# Altium schematic sheet TEST_PLATFORM.SchDoc
size A4
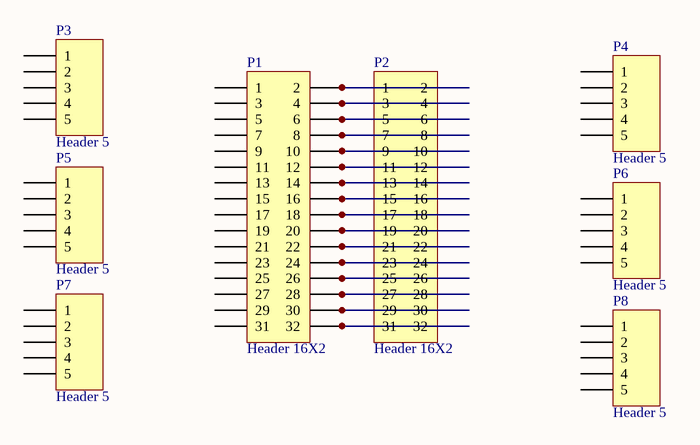
[diagram p0: TEST_PLATFORM.SchDoc]

## Parts
P1  Header 16X2  [HDR2X16]
P2  Header 16X2  [HDR2X16]
P3  Header 5  [HDR1X5]
P4  Header 5  [HDR1X5]
P5  Header 5  [HDR1X5]
P6  Header 5  [HDR1X5]
P7  Header 5  [HDR1X5]
P8  Header 5  [HDR1X5]

## Nets
NetP1_2: P1.2 P2.1 P2.2
NetP1_4: P1.4 P2.3 P2.4
NetP1_6: P1.6 P2.5 P2.6
NetP1_8: P1.8 P2.7 P2.8
NetP1_10: P1.10 P2.9 P2.10
NetP1_12: P1.12 P2.11 P2.12
NetP1_14: P1.14 P2.13 P2.14
NetP1_16: P1.16 P2.15 P2.16
NetP1_18: P1.18 P2.17 P2.18
NetP1_20: P1.20 P2.19 P2.20
NetP1_22: P1.22 P2.21 P2.22
NetP1_24: P1.24 P2.23 P2.24
NetP1_26: P1.26 P2.25 P2.26
NetP1_28: P1.28 P2.27 P2.28
NetP1_30: P1.30 P2.29 P2.30
NetP1_32: P1.32 P2.31 P2.32

Not connected (* = marked no-connect by the designer): P1 1 3 5 7 9 11 13 15 17 19 21 23 25 27 29 31; P3 1 2 3 4 5; P4 1 2 3 4 5; P5 1 2 3 4 5; P6 1 2 3 4 5; P7 1 2 3 4 5; P8 1 2 3 4 5

## Library data of the parts
P1 P2 = Header 16X2: Header, 16-Pin, Dual row; LatestRevisionDate: 17-Jul-2002; LatestRevisionNote: Re-released for DXP Platform.; Publisher: Altium Limited
P3-P8 = Header 5: Header, 5-Pin; LatestRevisionDate: 17-Jul-2002; LatestRevisionNote: Re-released for DXP Platform.; Publisher: Altium Limited